# EAGLE design OpenMV-Shield (EAGLE 9.1.1)
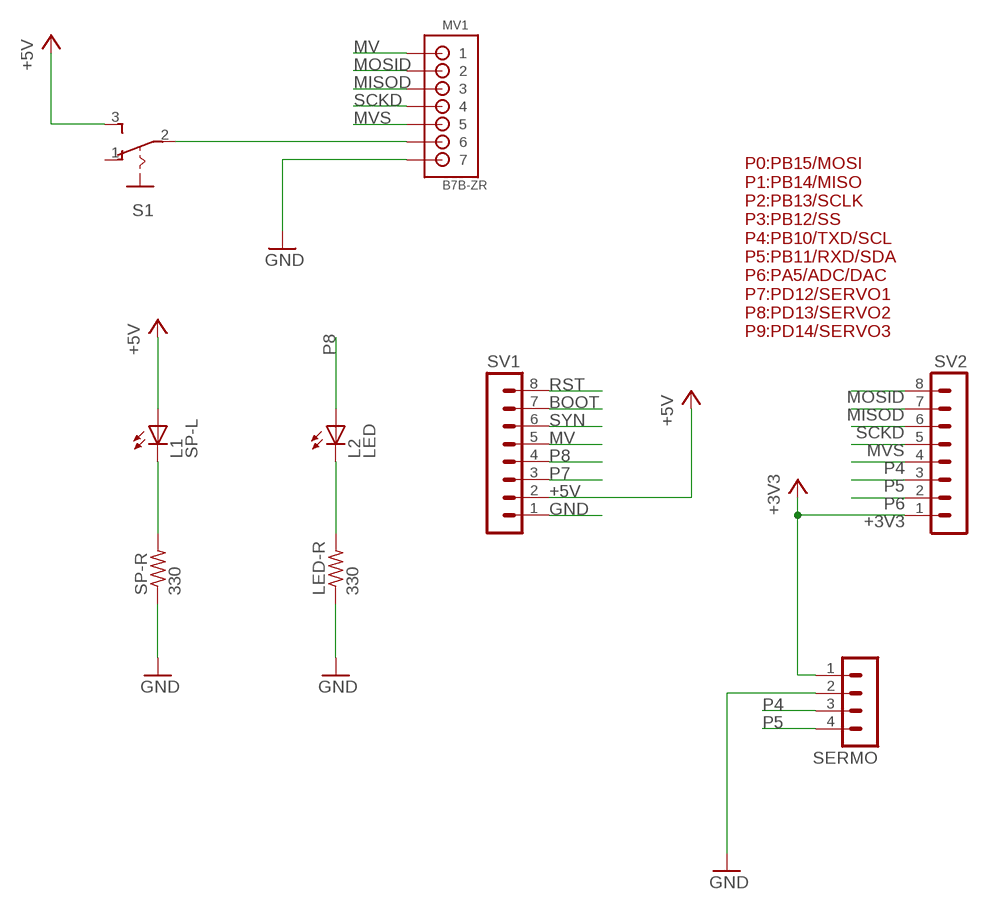
[diagram p0: schematic, sheet 1]

## Parts
L1  SP-L  LEDCHIPLED_0805  [CHIPLED_0805]
L2  LED  LEDCHIPLED_0805  [CHIPLED_0805]
LED-R  330  R-US_R0805  [R0805]
MV1  B7B-ZR  [B7B-ZR]
S1  M251  [M251]
SERMO  MA04-1  [MA04-1]
SP-R  330  R-US_R0805  [R0805]
SV1  MA08-1  [MA08-1]
SV2  MA08-1  [MA08-1]

## Nets
+3V3: SERMO.1 SV2.1
+5V: L1.A S1.3(S) SV1.2
BOOT: SV1.7
GND: LED-R.1 MV1.7 SERMO.2 SP-R.1 SV1.1
MISOD: MV1.3 SV2.7
MOSID: MV1.2 SV2.8
MV: MV1.1 SV1.5
MVS: MV1.5 SV2.5
N$1: MV1.6 S1.2(P)
N$2: L2.C LED-R.2
N$43: L1.C SP-R.2
P4: SERMO.3 SV2.4
P5: SERMO.4 SV2.3
P6: SV2.2
P7: SV1.3
P8: L2.A SV1.4
RST: SV1.8
SCKD: MV1.4 SV2.6
SYN: SV1.6
Unconnected: S1.1(O)

## Notes on the sheet
- P0:PB15/MOSI
  P1:PB14/MISO
  P2:PB13/SCLK
  P3:PB12/SS
  P4:PB10/TXD/SCL
  P5:PB11/RXD/SDA
  P6:PA5/ADC/DAC
  P7:PD12/SERVO1
  P8:PD13/SERVO2
  P9:PD14/SERVO3

## Library data of the parts
L1 L2 = led:LED: LED OSRAM: - CHIPLED LG R971, LG N971, LY N971, LG Q971, LY Q971, LO R971, LY R971 LH N974, LH R974 LS Q976, LO Q976, LY Q976 LO Q996 - Hyper CHIPLED LW Q18S LB Q993, LB Q99A, LB R99A - SideLED LS A670, LO A670, LY A670, LG A670, LP A670 LB A673, LV A673, LT A673, LW A673 LH A674 LY A675 LS A676, LA A676, LO A676, LY A676, LW A676 LS A679, LY A679, LG A679 - Hyper Micro SIDELED® LS Y876, LA Y876, LO Y876, LY Y876 LT Y87S - SmartLED LW L88C, LW L88S LB L89C, LB L89S, LG L890 LS L89K, LO L89K, LY L89K LS L896, LA L896, LO L896, LY L896 - TOPLED LS T670, LO T670, LY T670, LG T670, LP T670 LSG T670, LSP T670, LSY T670, LOP T670, LYG T670 LG T671, LOG T671, LSG T671 LB T673, LV T673, LT T673, LW T673 LH T674 LS T676, LA T676, LO T676, LY T676, LB T676, LH T676, LSB T676, LW T676 LB T67C, LV T67C, LT T67C, LS T67K, LO T67K, LY T67K, LW E67C LS E67B, LA E67B, LO E67B, LY E67B, LB E67C, LV E67C, LT E67C LW T67C LS T679, LY T679, LG T679 LS T770, LO T770, LY T770, LG T770, LP T770 LB T773, LV T773, LT T773, LW T773 LH T774 LS E675, LA E675, LY E675, LS T675 LS T776, LA T776, LO T776, LY T776, LB T776 LHGB T686 LT T68C, LB T68C - Hyper Mini TOPLED® LB M676 - Mini TOPLED Santana® LG M470 LS M47K, LO M47K, LY M47K Source: http://www.osram.convergy.de LUXEON: - LUMILED® LXK2-PW12-R00, LXK2-PW12-S00, LXK2-PW14-U00, LXK2-PW14-V00 LXK2-PM12-R00, LXK2-PM12-S00, LXK2-PM14-U00 LXK2-PE12-Q00, LXK2-PE12-R00, LXK2-PE12-S00, LXK2-PE14-T00, LXK2-PE14-U00 LXK2-PB12-K00, LXK2-PB12-L00, LXK2-PB12-M00, LXK2-PB14-N00, LXK2-PB14-P00, LXK2-PB14-Q00 LXK2-PR12-L00, LXK2-PR12-M00, LXK2-PR14-Q00, LXK2-PR14-R00 LXK2-PD12-Q00, LXK2-PD12-R00, LXK2-PD12-S00 LXK2-PH12-R00, LXK2-PH12-S00 LXK2-PL12-P00, LXK2-PL12-Q00, LXK2-PL12-R00 Source: www.luxeon.com KINGBRIGHT: KA-3528ASYC Source: www.kingbright.com
LED-R SP-R = 0@Mylibrary-main1:R-US_: RESISTOR, American symbol
MV1 = jst:B7B-ZR
S1 = switch:M251: SLIDING SWITCH Mors, distributor Buerklin, 11G702
SERMO = 0con-lstb:MA04-1: PIN HEADER; OC_FARNELL: unknown; OC_NEWARK: unknown
SV1 SV2 = 0con-lstb:MA08-1: PIN HEADER; OC_FARNELL: unknown; OC_NEWARK: unknown

## Board
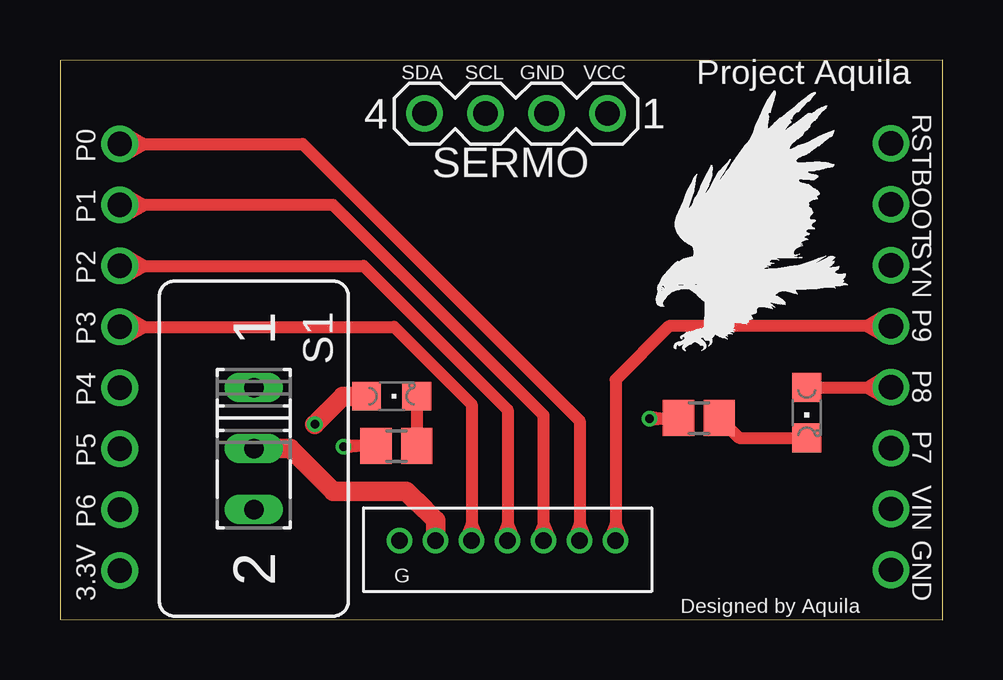
[diagram p1: board, top side]
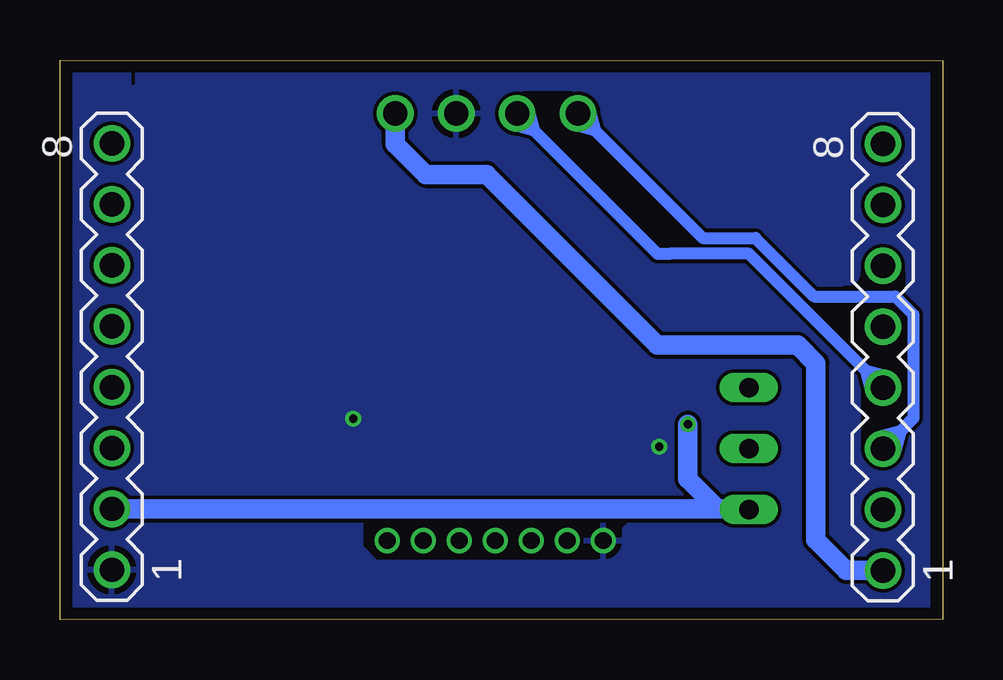
[diagram p2: board, bottom side, seen from below]

Size 36.78 x 23.34 mm. Coordinates in mm from the lower left corner, seen from the top.
Outline: 0,0.03 36.78,0 36.78,23.34 0,23.32 0,0.03
Copper layers (1*16): Top 0.035mm / dielectric 1.6mm / Bottom 0.035mm
Design rules "Elecrow_2-layer_PCB_eagle_rule": minimum track width 6mil, minimum drill 12mil, track to track 6mil, track to pad 6mil, pad to pad 6mil, via to via 8mil, smd to smd 0mil, copper to edge 20mil, drill to drill 10mil, minimum pad ring 6mil, minimum via ring 6mil, stop-mask expansion 0mil, vias tented up to drill 100mil, thermal gap 10mil
bRestrict: 11 lines

### Footprints (pad centres in the part's own frame; a part is rotated, then mirrored left to right if it is on the bottom)
CHIPLED_0805 = smd 1.2 x 1.2: A 0,-1.05; C 0,1.05
R0805 = smd 1.3 x 1.5: 1 -0.85,0; 2 0.85,0
B7B-ZR = drill 0.7: 1 10.5,-1.3; 2 9,-1.3; 3 7.5,-1.3; 4 6,-1.3; 5 4.5,-1.3; 6 3,-1.3; 7 1.5,-1.3
M251 = drill 0.813 long: 1 -2.54,0; 2 0,0; 3 2.54,0
MA04-1 = drill 1.016: 1 -3.81,0; 2 -1.27,0; 3 1.27,0; 4 3.81,0
MA08-1 = drill 1.016: 1 -8.89,0; 2 -6.35,0; 3 -3.81,0; 4 -1.27,0; 5 1.27,0; 6 3.81,0; 7 6.35,0; 8 8.89,0

### Placement (x,y rotation side)
L1  13.82,9.32 270 top
L2  31.12,8.64 180 top
LED-R  26.62,8.41 0 top
MV1  12.65,4.6 0 top
S1  8.08,7.14 270 top
SERMO  19,21.11 180 top
SP-R  14.02,7.24 0 top
SV1  34.62,10.97 90 bottom
SV2  2.49,10.95 90 bottom
U$1  [EAGLE-PLC-8MM]  24.84,11.2 0 top

### Tracks (layer width: path | path; a pad name or v marks a point on that pad's centre or on a via)
+3V3
  Bottom 0.813: SERMO.1 22.81,19.84 21.54,18.57 19,18.57 11.89,11.46 6.05,11.46 5.28,10.69 5.28,3.33 4.01,2.06 SV2.1
+5V  (via drill 0.35)
  Top 0.813: L1.A 11.79,9.32 v10.62,8.15
  Bottom 0.813: S1.3 8.1,4.62 9.37,4.62 | SV1.2 9.37,4.62 | v10.62,8.15 10.62,5.87 9.37,4.62
GND  (via drill 0.35)
  Top 0.508: LED-R.1 arc-90 25.74,8.38 25.09,8.38 | 25.09,8.38 v24.56,8.38 | SP-R.1 12.34,7.24 | 12.34,7.24 12.09,7.24 v11.81,7.21 | 25.09,8.38 24.57,8.45 v24.56,8.38 | 25.09,8.38 24.57,8.31 v24.56,8.38 | 12.34,7.24 11.82,7.29 v11.81,7.21 | 12.34,7.24 11.83,7.14 v11.81,7.21
  pour Bottom: -0.05,24.92 36.78,24.92 36.78,-0.48 -0.05,-0.48
MISOD
  Top 0.508: MV1.3 20.15,4 | 20.15,4 20.15,8.53 11.38,17.3 3.51,17.3 | 3.51,17.3 SV2.7 | 20.15,4 19.9,3.4 MV1.3 | 20.15,4 20.4,3.4 MV1.3 | 3.51,17.3 2.74,17.74 SV2.7 | 3.51,17.3 2.74,16.86 SV2.7
MOSID
  Top 0.508: SV2.8 3.51,19.84 | 3.51,19.84 10.11,19.84 21.65,8.3 21.65,4 | 21.65,4 MV1.2 | 21.65,4 21.4,3.4 MV1.2 | 21.65,4 21.9,3.4 MV1.2 | 3.51,19.84 2.74,20.28 SV2.8 | 3.51,19.84 2.74,19.4 SV2.8
MV
  Top 0.508: 23.15,4 23.15,10.02 25.37,12.24 33.6,12.24 | 23.15,4 MV1.1 | SV1.5 33.6,12.24 | 23.15,4 22.9,3.4 MV1.1 | 23.15,4 23.4,3.4 MV1.1 | 33.6,12.24 34.37,11.8 SV1.5 | 33.6,12.24 34.37,12.68 SV1.5
MVS
  Top 0.508: SV2.5 3.51,12.22 | 3.51,12.22 13.92,12.22 17.15,8.99 17.15,4 | 17.15,4 MV1.5 | 3.51,12.22 2.74,12.66 SV2.5 | 3.51,12.22 2.74,11.78 SV2.5 | 17.15,4 16.9,3.4 MV1.5 | 17.15,4 17.4,3.4 MV1.5
N$1
  Top 0.813: MV1.6 15.65,4.14 15.19,4.6 14.43,5.36 11.38,5.36 9.6,7.14 S1.2
N$2
  Top 0.508: LED-R.2 28.29,7.59 L2.C
N$43
  Top 0.508: L1.C SP-R.2
P4
  Bottom 0.508: SERMO.3 17.01,20.39 | 17.01,20.39 11.89,15.27 11.38,15.27 8.08,15.27 3.21,10.4 | SV2.4 3.21,10.4 | 3.21,10.4 2.36,10.17 SV2.4 | 3.21,10.4 2.98,9.55 SV2.4 | 17.01,20.39 17.86,20.62 SERMO.3 | 17.01,20.39 17.24,21.24 SERMO.3
P5
  Bottom 0.508: SERMO.4 14.47,20.39 | 14.47,20.39 10.01,15.93 7.8,15.93 5.37,13.49 1.98,13.49 1.22,12.73 1.22,8.41 1.77,7.86 | SV2.3 1.77,7.86 | 1.77,7.86 2,7.01 SV2.3 | 1.77,7.86 2.62,7.63 SV2.3 | 14.47,20.39 15.32,20.62 SERMO.4 | 14.47,20.39 14.7,21.24 SERMO.4
P8
  Top 0.508: L2.A 33.6,9.69 | 33.6,9.69 34.6,9.69 | 33.6,9.69 34.37,9.26 SV1.4 34.36,10.14 33.6,9.69
  Top 0.61: 34.6,9.69 SV1.4
SCKD
  Top 0.508: 18.65,4 18.65,8.76 12.65,14.76 3.51,14.76 | 18.65,4 MV1.4 | SV2.6 3.51,14.76 | 18.65,4 18.4,3.4 MV1.4 | 18.65,4 18.9,3.4 MV1.4 | 3.51,14.76 2.74,15.2 SV2.6 | 3.51,14.76 2.74,14.32 SV2.6

### Text on the board
tPlace: Project Aquila
tNames: SDA | SCL | GND | VCC | RST | P0 | BOOT | P1 | SYN | P2 | P9 | P3 | P8 | P4 | P7 | P5 | VIN | P6 | GND | G | 3.3V | Designed by Aquila
tValues: 2018 | P0:PB15/MOSI / P1:PB14/MISO / P2:PB13/SCLK / P3:PB12/SS / P4:PB10/TXD/SCL / P5:PB11/RXD/SDA / P6:PA5/ADC/DAC / P7:PD12/SERVO1 / P8:PD13/SERVO2 / P9:PD14/SERVO3